# Altium schematic sheet USB.SchDoc
size A4
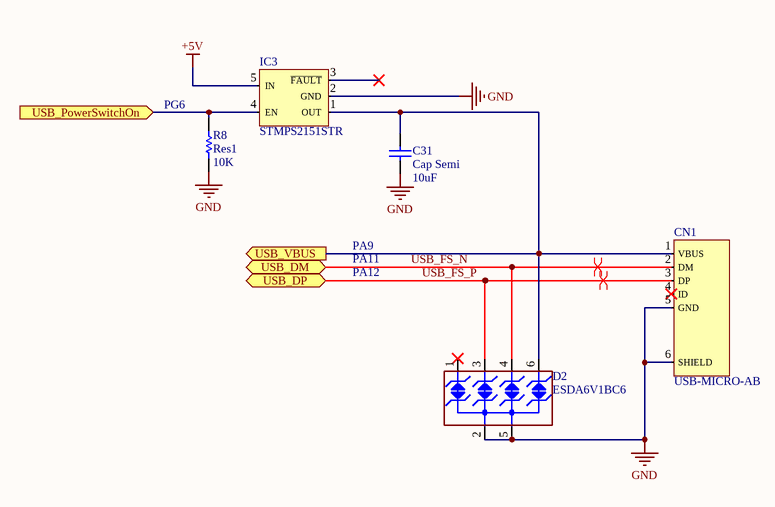
[diagram p0: USB.SchDoc]

## Parts
C31  Cap Semi  value 10uF  [CAP_TANT1206]
CN1  USB-MICRO-AB  [USB-MICRO-AB]
D2  ESDA6V1BC6  [SOT23-6L]
IC3  STMPS2151STR  [SOT23-5L]
R8  Res1  value 10K  [RES0402]

## Ports
USB_DM (bidir), USB_DP (bidir), USB_PowerSwitchOn (in), USB_VBUS (out)

## Nets
+5V: IC3.5(IN)
GND: C31.1 CN1.5(GND) CN1.6(SHIELD) D2.2(IO2) D2.5(IO4) IC3.2(GND) R8.1
USB_FS_N: CN1.2(DM) D2.4(IO3) ; port USB_DM
USB_FS_P: CN1.3(DP) D2.3(GND) ; port USB_DP
USB_PowerSwitchOn: IC3.4(EN) R8.2 ; port USB_PowerSwitchOn
USB_VBUS: C31.2 CN1.1(VBUS) D2.6(NC) IC3.1(OUT) ; port USB_VBUS

Not connected (* = marked no-connect by the designer): CN1 4(ID)*; D2 1(IO1)*; IC3 3(~{FAULT})*

## Layout directives
differential pair: USB_FS_N, USB_FS_P

## Notes on the sheet
- (near R8) PG6
- PA11
- PA9
- PA12

## Library data of the parts
C31 = Cap Semi: Tantalum Capacitors - Solid SMD 16V 10uF 1206 10% ESR=3Ohms; Mfr. No: T491A106K016AT; PackageReference: SMD-1206(3216 metric); PackageDescription: Tantalum Capacitor; Mouser No: 80-T491A106K016
CN1 = USB-MICRO-AB: USB Connectors WR-COM USB Micro SMT Type AB Horiztl; Mfr. No: 629105150921; Mouser No: 710-629105150921
D2 = ESDA6V1BC6: ESD Suppressors / TVS Diodes 6.1V 80W Bidirect; Manuf_1: STM; Manuf_Part_1: ESDA5V3L; Ref St: 9179034; Provided: ST; ECCN_US/EU: EAR99/NEC; Distrib: ST; Order: ESDA5V3L; Ordered by: STM; Mfr. No: ESDA6V1BC6; Mouser No: 511-ESDA6V1BC6
IC3 = STMPS215: Power Switch ICs - Power Distribution SGL CHNL PWR SWTCH; Mfr. No: STMPS2151STR; Mouser No: 511-STMPS2151STR
R8 = Res1: Thick Film Resistors - SMD 0.2watt 10Kohms 1% 100ppm; Mfr. No: RCS040210K0FKED; PackageReference: SMD-0402(1005 metric); PackageDescription: Chip Resistor; Mouser No: 71-RCS040210K0FKED